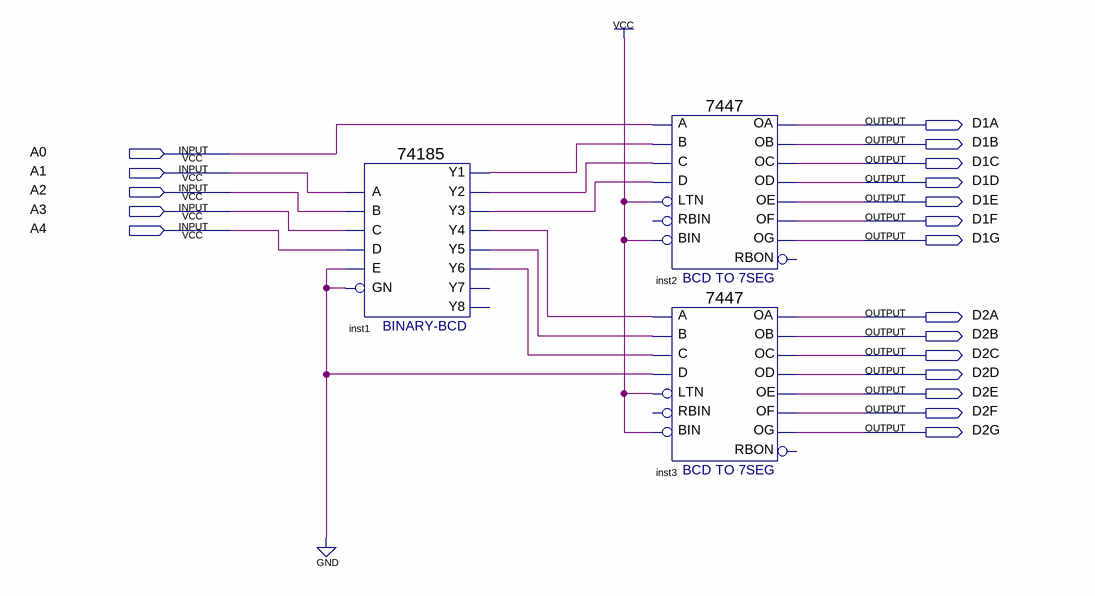
[diagram p0: schematic sheet]
// Quartus schematic lab3_pre.bdf as structural Verilog: 3 symbols, 19 pins
module lab3_pre (
  input  A0,
  input  A1,
  input  A2,
  input  A3,
  input  A4,
  output D1A,
  output D1B,
  output D1C,
  output D1D,
  output D1E,
  output D1F,
  output D1G,
  output D2A,
  output D2B,
  output D2C,
  output D2D,
  output D2E,
  output D2F,
  output D2G
);

  wire inst1_y1, inst1_y2, inst1_y3, inst1_y4, inst1_y5, inst1_y6;

  \74185  inst1 (
    .A(A1), .B(A2), .D(A4), .C(A3), .E(1'b0), .GN(1'b0), .Y1(inst1_y1), .Y3(inst1_y3), .Y2(inst1_y2),
    .Y5(inst1_y5), .Y4(inst1_y4), .Y6(inst1_y6));  // open: Y8, Y7
  \7447  inst2 (
    .LTN(1'b1), .B(inst1_y1), .C(inst1_y2), .D(inst1_y3), .BIN(1'b1), .A(A0), .OB(D1B), .OC(D1C), .OE(D1E),
    .OD(D1D), .OF(D1F), .OG(D1G), .OA(D1A));  // open: RBIN, RBON
  \7447  inst3 (
    .LTN(1'b1), .B(inst1_y5), .C(inst1_y6), .D(1'b0), .BIN(1'b1), .A(inst1_y4), .OB(D2B), .OC(D2C), .OE(D2E),
    .OD(D2D), .OF(D2F), .OG(D2G), .OA(D2A));  // open: RBIN, RBON
endmodule
